# Altium schematic sheet TDDswitches.SchDoc: Title
size 420 x 297 mm; CheckedBy: -; CompanyName: CERN; DrawnBy: DrawnBy; Organization: CERN; Address1: European Organization for Nuclear Research; Address2: CH-1211 Genčve 23 - Switzerland; DocumentNumber: 5; Revision: -; SheetNumber: 5; SheetTotal: 10; EDA_Number: EDA-XXXXX-VX-X; Projet: -; ModifiedBy: -; CreateDate: XX/XX/XXXX; CheckedDate: -; Title2: Title2; DivGrp: TE/MPE; Designer: Designer; ModifiedDate: -
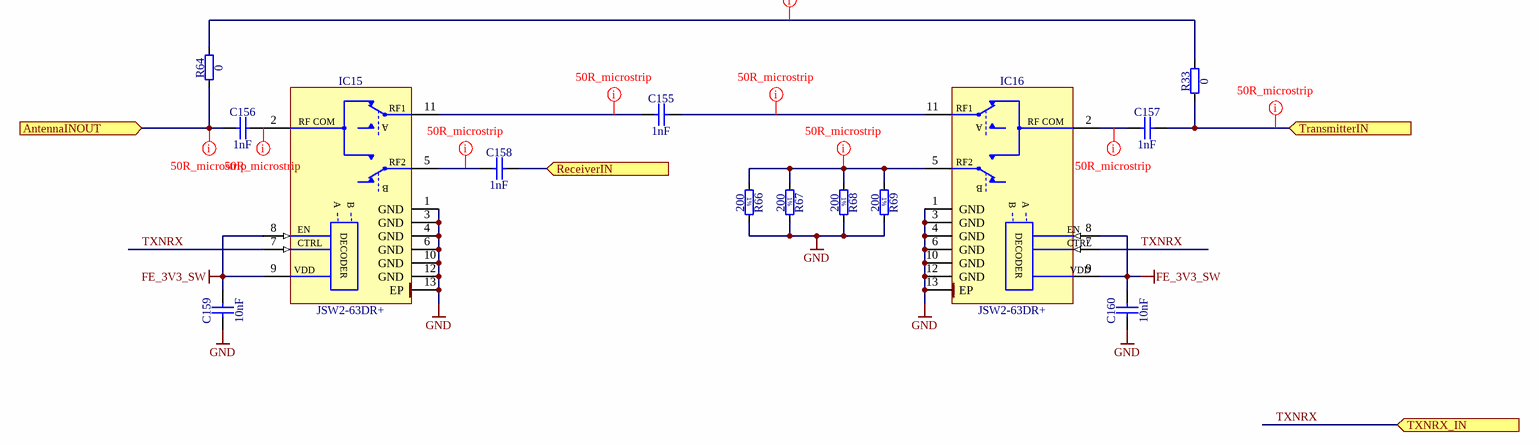
[diagram p0: TDDswitches.SchDoc]

## Parts
C155  1nF  [CAPC1005X55N]
C156  1nF  [CAPC1005X55N]
C157  1nF  [CAPC1005X55N]
C158  1nF  [CAPC1005X55N]
C159  10nF  [CAPC1005X55N]
C160  10nF  [CAPC1005X55N]
IC15  JSW2-63DR+  [MINI-CIRCUITS_MT1818]
IC16  JSW2-63DR+  [MINI-CIRCUITS_MT1818]
R33  0  [RESC1005X40N]
R64  0  [RESC1005X40N]
R66  200  [RESC3216X65N]
R67  200  [RESC3216X65N]
R68  200  [RESC3216X65N]
R69  200  [RESC3216X65N]

## Ports
AntennaINOUT (in), ReceiverIN (in), TransmitterIN (in), TXNRX_IN (in)

## Nets
FE_3V3_SW: C159.2 C160.2 IC15.8(EN) IC15.9(VDD) IC16.8(EN) IC16.9(VDD)
GND: C159.1 C160.1 IC15.1(GND) IC15.3(GND) IC15.4(GND) IC15.6(GND) IC15.10(GND) IC15.12(GND) IC15.13(EP) IC16.1(GND) IC16.3(GND) IC16.4(GND) IC16.6(GND) IC16.10(GND) IC16.12(GND) IC16.13(EP) R66.2 R67.2 R68.2 R69.2
AntennaINOUT: C156.1 R64.1 ; port AntennaINOUT
ReceiverIN: C158.2 ; port ReceiverIN
TransmitterIN: C157.2 R33.1 ; port TransmitterIN
TXNRX: IC15.7(CTRL) IC16.7(CTRL) ; port TXNRX_IN
NetC155_1: C155.1 IC15.11(RF1)
NetC155_2: C155.2 IC16.11(RF1)
NetC156_2: C156.2 IC15.2(RF_COM)
NetC157_1: C157.1 IC16.2(RF_COM)
NetC158_1: C158.1 IC15.5(RF2)
NetIC16_5: IC16.5(RF2) R66.1 R67.1 R68.1 R69.1
NetR33_2: R33.2 R64.2

## Layout directives
net class 50R_class: AntennaINOUT, NetC155_1, NetC155_2, NetC156_2, NetC157_1, NetC158_1, NetIC16_5, NetR33_2, TransmitterIN

## Notes on the sheet
- Project/Equipment
- Document
- Designer
- Drawn by
- Check.by
- File
- Last Mod.
- Print Date
- Sheet
- Size
- A3
- of
- Rev
- (in symbol JSW2-63DR+) A; B; DECODER
- (in symbol R1206_200R_1%_0.25W_100PPM) 1%

## Library data of the parts
C155-C158 = CC0402_1NF_50V_10%_X7R: Non-polarised capacitor; Part Description: SMD Multilayer Chip Ceramic Capacitor; Manufacturer: GENERIC; Manufacturer1 Part Number: 223858715623; Voltage: 50V; TC: X7R; Tolerance: ±10%; Part Number: CC0402_1NF_50V_10%_X7R; Component Kind: Standard; Component Type: Standard; Pin Count: 2; Value: 1nF; Status: Not Recommended; Manufacturer Part Number: CC0402_1NF_50V_10%_X7R; Case: 0402; Mounted: Yes; Socket: No; SMD: Yes; Sense: No; Manufacturer1 Example: PHYCOMP; Manufacturer1 ComponentHeight: 0.55mm; HelpURL: \\cern.ch\dfs\Applications\Altium\Datasheets\CC0402_X7R_PHYCOMP.pdf; Author: CERN DEM JLC; CreateDate: 03.12.2007; LatestRevisionDate: 03.12.2007
C159 C160 = CC0402_10NF_50V_10%_X7R: Non-polarised capacitor; Part Description: SMD Multilayer Chip Ceramic Capacitor; Manufacturer: GENERIC; Manufacturer1 Part Number: GRM155R71H103KA88D; Voltage: 50V; TC: X7R; Tolerance: ±10%; Part Number: CC0402_10NF_50V_10%_X7R; Component Kind: Standard; Component Type: Standard; Pin Count: 2; Value: 10nF; Status: None; Manufacturer Part Number: CC0402_10NF_50V_10%_X7R; Case: 0402; Mounted: Yes; Socket: No; SMD: Yes; Sense: No; Manufacturer1 Example: MURATA; Manufacturer1 ComponentHeight: 0.55mm; HelpURL: \\cern.ch\dfs\Applications\Altium\Datasheets\CC0402_X7R_MURATA_GRM.pdf; Author: CERN DEM MR; CreateDate: 08.01.2016; LatestRevisionDate: 08.01.2016
IC15 IC16 = JSW2-63DR+: SPDT RF Switch, 50 Ohm, 5 to 6000MHz, High Power 3W; Part Description: SPDT RF Switch, 50 Ohms, 5 to 6000MHz, High Power 3W; Manufacturer: MINI-CIRCUITS; PressFit: No; Bonding: No; Part Number: JSW2-63DR+; Component Kind: Standard; Component Type: Standard; Device: JSW2-63DR+; PackageDescription: MINI-CIRCUITS MT1818 Case, Body 2.06mm L X 2.06mm W X 0.61mm H; Manufacturer Part Number: JSW2-63DR+; Pin Count: 13; Mounted: Yes; Socket: No; SMD: Yes; Sense: No; ComponentHeight: 0.61mm; Author: CERN DEM JMW; HelpURL: \\cern.ch\dfs\Applications\Altium\Datasheets\JSW2-63DR+.pdf; CreateDate: 11.08.2016; LatestRevisionDate: 11.08.2016
R33 R64 = R0402_0R_JUMPER: Resistor; Part Description: 1A (0.05R Max DC Resistance) Zero Ohm Jumper; Manufacturer: GENERIC; Manufacturer1 Part Number: 232270591001L; PressFit: No; Part Number: R0402_0R_JUMPER; Component Kind: Standard; Component Type: Standard; Pin Count: 2; Value: 0; Status: Not Recommended; Manufacturer Part Number: R0402_0R_JUMPER; Case: 0402; Mounted: Yes; Sense: No; Socket: No; SMD: Yes; Manufacturer1 Example: YAGEO PHYCOMP; Manufacturer1 ComponentHeight: 0.4mm; HelpURL: \\cern.ch\dfs\Applications\Altium\Datasheets\R0402_Phycomp_RC0402.pdf; Author: CERN DEM JLC; CreateDate: 03.12.2007; LatestRevisionDate: 17.10.2012
R66-R69 = R1206_200R_1%_0.25W_100PPM: Resistor - 1%; Part Description: General Purpose Thick Film Chip Resistor; Manufacturer: GENERIC; Manufacturer1 Part Number: NRC12F2000TRF; Power: 0.25W; TC: ±100ppm/°C; PressFit: No; Part Number: R1206_200R_1%_0.25W_100PPM; Component Kind: Standard; Component Type: Standard; Pin Count: 2; Value: 200; Status: Preferred; Tolerance: ±1%; Manufacturer Part Number: R1206_200R_1%_0.25W_100PPM; Case: 1206; Mounted: Yes; Sense: No; Socket: No; SMD: Yes; Manufacturer1 Example: NIC COMPONENT; Manufacturer1 ComponentHeight: 0.65mm; HelpURL: \\cern.ch\dfs\Applications\Altium\Datasheets\R1206_NIC_NRC.pdf; Author: CERN DEM JLC; CreateDate: 03.12.2007; LatestRevisionDate: 13.03.2008